# EAGLE design TinyFaceWatch (EAGLE 7.6.0)
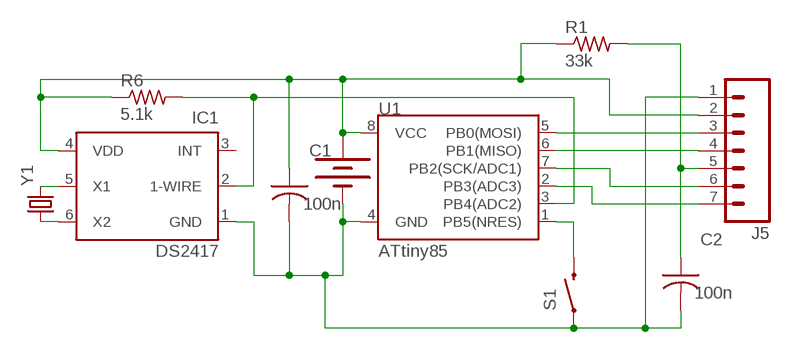
[diagram p0: schematic, sheet 1]

## Parts
BAT1  20mm coincell  BATTERY20MM_4LEGS  [BATTCON_20MM_4LEGS]
C1  100n  C-USC0805K  [C0805K]
C2  100n  C-USC0805K  [C0805K]
IC1  DS2417  DS2417P  [TSOC6]
J5  M07  [1X07]
R1  33k  R-US_M0805  [M0805]
R6  5.1k  R-US_M0805  [M0805]
S1  SWITCH-MOMENTARY-2SMD-4.6X2.8MM  [TACTILE_SWITCH_SMD_4.6X2.8MM]
U1  ATtiny85  ATTINY45TINY45-20-SMT  [SO08-EIAJ]
Y1  CRYSTAL32-SMD-MELF  [CRYSTAL-32KHZ-SMD-MELF]

## Nets
N$1: IC1.5(X1) Y1.X2
N$2: IC1.6(X2) Y1.X1
N$3: J5.4 U1.6(PB1(MISO))
N$4: J5.3 U1.5(PB0(MOSI))
N$5: J5.6 U1.7(PB2(SCK/ADC1))
N$6: J5.7 U1.2(PB3(ADC3))
N$7: BAT1.POSITIVE@1(+) BAT1.POSITIVE@2(+) BAT1.POSITIVE@3(+) BAT1.POSITIVE@4(+) C1.1 IC1.4(VDD) J5.2 R1.1 R6.1 U1.8(VCC)
N$8: C2.1 J5.5 R1.2
N$9: BAT1.NEGATIVE(-) C1.2 C2.2 IC1.1(GND) J5.1 S1.1 S1.2 U1.4(GND)
N$10: S1.3 S1.4 U1.1(PB5(NRES))
N$11: IC1.2(1-WIRE) R6.2 U1.3(PB4(ADC2))

## Power pins joined to a net without a drawn wire
INT: IC1.3(INT)

## Library data of the parts
BAT1 = SparkFun-Electromechanical:BATTERY: Battery Holders Various common sizes : AA, AAA, 18650 (PRT-12895), 20mm coin cell and 12mm coin cell. 20MM_4LEGS, BATT-10373; PROD_ID: BATT-10373
C1 C2 = adafruit:C-US: CAPACITOR, American symbol
IC1 = maxim:DS2417: 1-Wire Digital Potentiometer DALLAS Semiconductor; http://www.maxim-ic.com/; OC_FARNELL: unknown; OC_NEWARK: unknown
J5 = SparkFun-Connectors:M07: Header 7 Standard 7-pin 0.1" header. Use with straight break away headers (SKU : PRT-00116), right angle break away headers (PRT-00553), swiss pins (PRT-00743), machine pins (PRT-00117), and female headers (PRT-00115). NOTES ON THE VARIANTS LOCK and LOCK_LONGPADS... This footprint was designed to help hold the alignment of a through-hole component (i.e. 7-pin header) while soldering it into place. You may notice that each hole has been shifted either up or down by 0.005 of an inch from it's more standard position (which is usually a perfectly straight line). This slight alteration caused the pins (the squares in the middle) to touch the edges of the holes. Because they are alternating, it causes a "brace" to hold the header in place. 0.005 has proven to be the perfect amount of "off-center" position when using our standard breakaway headers. Although looks a little odd when you look at the bare footprint, once you have a header in there, the alteration is very hard to notice. Also, if you push a header all the way into place, it is covered up entirely on the bottom side. This idea of altering the position of holes to aid alignment will be further integrated into the Sparkfun Library for other footprints. It can help hold any component with 3 or more connection pins.
R1 R6 = adafruit:R-US_: RESISTOR, American symbol
S1 = SparkFun-Electromechanical:SWITCH-MOMENTARY-2: Various NO switches- pushbuttons, reed, etc; PROD_ID: SWCH-13065
U1 = SparkFun-DigitalIC:ATTINY45: Atmel 8-pin 2/4/8kB flash uC; PROD_ID: IC-08922; VALUE: Tiny45-20-SMT
Y1 = SparkFun-FreqCtrl:CRYSTAL: Various standard crystals. Proven footprints.; PROD_ID: XTAL-07894

## Board
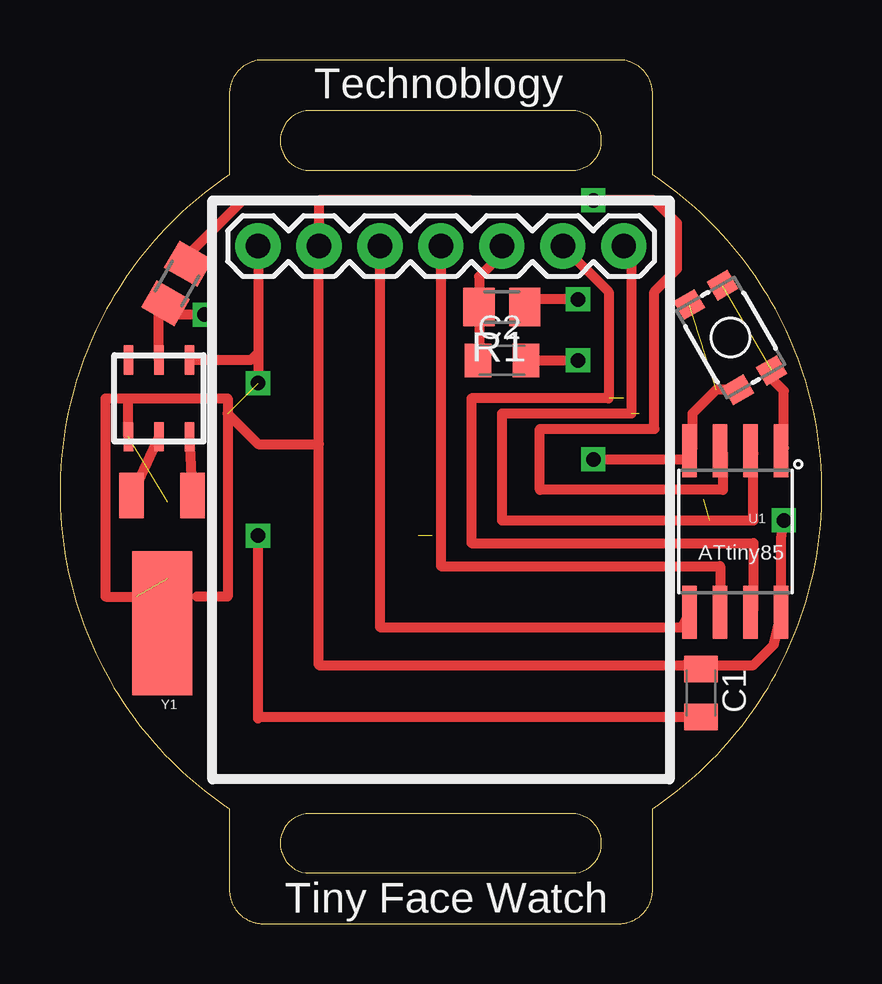
[diagram p1: board, top side]
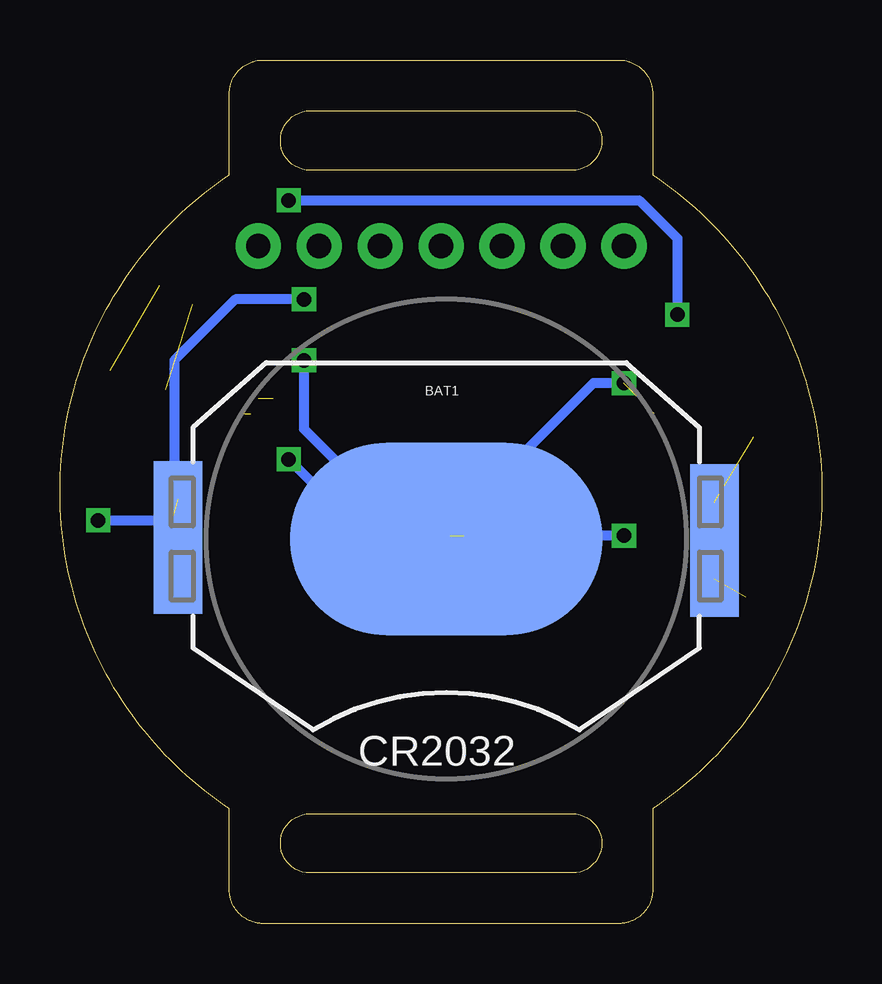
[diagram p2: board, bottom side, seen from below]

Size 31.75 x 35.98 mm. Coordinates in mm from the lower left corner, seen from the top.
Outline: 7.23,0.74 7.2,0.78 7.18,0.82 7.17,0.86 7.15,0.9 7.13,0.95 7.12,0.99 7.11,1.04 7.09,1.08 7.08,1.13 7.08,1.17 7.07,1.22 7.06,1.27 7.06,1.31 7.06,1.36 7.06,4.79 6.79,4.97 6.53,5.15 6.28,5.35 6.02,5.54 5.77,5.74 5.53,5.95 5.29,6.16 5.05,6.37 4.82,6.59 4.6,6.82 4.37,7.05 4.16,7.28 3.94,7.52 3.74,7.76 3.33,8.25 3.14,8.51 2.77,9.03 2.59,9.29 2.42,9.56 2.25,9.84 2.09,10.11 1.78,10.68 1.63,10.96 1.5,11.26 1.36,11.55 1.23,11.85 1.11,12.15 0.99,12.45 0.88,12.75 0.78,13.06 0.68,13.37 0.59,13.69 0.5,14.01 0.42,14.33 0.35,14.65 0.29,14.97 0.22,15.3 0.17,15.63 0.09,16.29 0.05,16.63 0.03,16.97 0.01,17.31 0,17.65 0,18.34 0.01,18.68 0.03,19.02 0.05,19.35 0.09,19.69 0.13,20.02 0.17,20.35 0.22,20.68 0.29,21.01 0.35,21.33 0.42,21.66 0.5,21.98 0.59,22.29 0.68,22.61 0.78,22.92 0.88,23.23 0.99,23.53 1.11,23.84 1.23,24.14 1.36,24.43 1.5,24.73 1.63,25.02 1.78,25.31 1.93,25.59 2.09,25.87 2.25,26.15 2.42,26.42 2.59,26.69 2.77,26.96 3.14,27.48 3.33,27.73 3.53,27.98 3.74,28.23 3.94,28.47 4.16,28.7 4.37,28.94 4.6,29.17 4.82,29.39 5.05,29.61 5.29,29.83 5.53,30.03 5.77,30.24 6.02,30.44 6.28,30.64 6.53,30.83 6.79,31.01 7.06,31.19 7.06,34.62 7.06,34.67 7.06,34.72 7.07,34.76 7.08,34.81 7.08,34.86 7.09,34.9 7.11,34.95 7.12,34.99 7.13,35.04 7.15,35.08 7.17,35.12 7.18,35.16 7.2,35.2 7.23,35.24 7.25,35.28 7.27,35.32 7.3,35.36 7.32,35.4 7.35,35.43 7.38,35.47 7.41,35.5 7.44,35.54 7.5,35.6 7.53,35.63 7.57,35.66 7.6,35.69 7.64,35.72 7.68,35.74 7.72,35.77 7.75,35.79 7.79,35.81 7.83,35.83 7.88,35.85 7.92,35.87 7.96,35.89 8,35.91 8.05,35.92 8.09,35.93 8.14,35.94 8.23,35.96 8.28,35.97 8.32,35.98 8.37,35.98 8.42,35.98 23.33,35.98 23.38,35.98 23.43,35.98 23.48,35.97 23.52,35.96 23.61,35.94 23.66,35.93 23.7,35.92 23.75,35.91 23.79,35.89 23.83,35.87 23.88,35.85 23.92,35.83 23.96,35.81 24,35.79 24.04,35.77 24.07,35.74 24.11,35.72 24.15,35.69 24.18,35.66 24.22,35.63 24.25,35.6 24.28,35.57 24.31,35.54 24.34,35.5 24.37,35.47 24.4,35.43 24.43,35.4 24.45,35.36 24.48,35.32 24.5,35.28 24.52,35.24 24.55,35.2 24.57,35.16 24.58,35.12 24.6,35.08 24.62,35.04 24.63,34.99 24.65,34.95 24.66,34.9 24.67,34.86 24.68,34.81 24.68,34.76 24.69,34.72 24.69,34.67 24.69,34.62 24.69,31.19 24.96,31.01 25.22,30.83 25.48,30.64 25.73,30.44 25.98,30.24 26.46,29.83 26.7,29.61 26.93,29.39 27.15,29.17 27.38,28.94 27.59,28.7 27.81,28.47 28.02,28.23 28.22,27.98 28.42,27.73 28.61,27.48 28.98,26.96 29.16,26.69 29.33,26.42 29.5,26.15 29.66,25.87 29.82,25.59 29.97,25.31 30.12,25.02 30.25,24.73 30.39,24.43 30.52,24.14 30.64,23.84 30.76,23.53 30.87,23.23 30.97,22.92 31.07,22.61 31.16,22.29 31.25,21.98 31.33,21.66 31.4,21.33 31.46,21.01 31.53,20.68 31.58,20.35 31.62,20.02 31.66,19.69 31.7,19.35 31.74,18.68 31.75,18.34 31.75,17.65 31.74,17.31 31.7,16.63 31.66,16.29 31.58,15.63 31.53,15.3 31.46,14.97 31.4,14.65 31.33,14.33 31.25,14.01 31.16,13.69 31.07,13.37 30.97,13.06 30.87,12.75 30.76,12.45 30.64,12.15 30.52,11.85 30.39,11.55 30.25,11.26 30.12,10.96 29.97,10.68 29.82,10.39 29.66,10.11 29.5,9.84 29.33,9.56 29.16,9.29 28.98,9.03 28.61,8.51 28.42,8.25 28.22,8.01 28.02,7.76 27.81,7.52 27.59,7.28 27.38,7.05 27.15,6.82 26.93,6.59 26.7,6.37 26.46,6.16 25.98,5.74 25.73,5.54 25.48,5.35 25.22,5.15 24.96,4.97 24.69,4.79 24.69,1.36 24.69,1.31 24.69,1.27 24.68,1.22 24.68,1.17 24.67,1.13 24.66,1.08 24.65,1.04 24.63,0.99 24.62,0.95 24.6,0.9 24.58,0.86 24.57,0.82 24.55,0.78 24.52,0.74 24.5,0.7 24.48,0.66 24.45,0.62 24.43,0.58 24.4,0.55 24.37,0.51 24.34,0.48 24.31,0.45 24.28,0.41 24.25,0.38 24.22,0.35 24.18,0.32 24.15,0.29 24.11,0.27 24.07,0.24 24.04,0.22 24,0.19 23.96,0.17 23.92,0.15 23.88,0.13 23.83,0.11 23.79,0.09 23.75,0.08 23.66,0.05 23.61,0.04 23.57,0.03 23.52,0.02 23.48,0.01 23.43,0.01 23.38,0 23.33,0 8.42,0 8.37,0 8.32,0.01 8.28,0.01 8.23,0.02 8.18,0.03 8.14,0.04 8.09,0.05 8.05,0.06 8,0.08 7.96,0.09 7.92,0.11 7.88,0.13 7.83,0.15 7.79,0.17 7.75,0.19 7.72,0.22 7.68,0.24 7.64,0.27 7.6,0.29 7.57,0.32 7.53,0.35 7.5,0.38 7.47,0.41 7.44,0.45 7.41,0.48 7.38,0.51 7.35,0.55 7.32,0.58 7.3,0.62 7.27,0.66 7.25,0.7
Outline: 21.5,33.86 10.24,33.86 10.08,33.82 9.93,33.76 9.79,33.7 9.65,33.61 9.54,33.5 9.43,33.39 9.34,33.25 9.28,33.11 9.21,32.96 9.18,32.79 9.18,32.45 9.21,32.29 9.28,32.14 9.34,32 9.43,31.86 9.54,31.75 9.65,31.64 9.79,31.55 9.93,31.49 10.08,31.42 10.24,31.39 21.5,31.39 21.66,31.42 21.81,31.49 21.96,31.55 22.09,31.64 22.2,31.75 22.31,31.86 22.4,32 22.47,32.14 22.53,32.29 22.56,32.45 22.56,32.79 22.53,32.96 22.47,33.11 22.4,33.25 22.31,33.39 22.2,33.5 22.09,33.61 21.96,33.7 21.81,33.76 21.66,33.82 21.5,33.86
Outline: 21.5,4.58 10.24,4.58 10.08,4.55 9.93,4.48 9.79,4.42 9.65,4.33 9.54,4.22 9.43,4.11 9.34,3.97 9.28,3.83 9.21,3.68 9.18,3.52 9.18,3.17 9.21,3.01 9.28,2.86 9.34,2.72 9.43,2.58 9.54,2.47 9.65,2.36 9.79,2.27 9.93,2.21 10.08,2.15 10.24,2.11 21.5,2.11 21.66,2.15 21.81,2.21 21.96,2.27 22.09,2.36 22.2,2.47 22.31,2.58 22.4,2.72 22.47,2.86 22.53,3.01 22.56,3.17 22.56,3.52 22.53,3.68 22.47,3.83 22.4,3.97 22.31,4.11 22.2,4.22 22.09,4.33 21.96,4.42 21.81,4.48 21.66,4.55 21.5,4.58
Copper layers (1*16): Top 0.035mm / dielectric 1.5mm / Bottom 0.035mm
Design rules "default": minimum track width 10mil, minimum drill 24mil, track to track 8mil, track to pad 8mil, pad to pad 8mil, via to via 8mil, smd to smd 8mil, copper to edge 40mil, drill to drill 8mil, minimum pad ring 10mil, minimum via ring 8mil, stop-mask expansion 4mil, vias tented up to drill 0mil, thermal gap 10mil

### Footprints (pad centres in the part's own frame; a part is rotated, then mirrored left to right if it is on the bottom)
BATTCON_20MM_4LEGS = smd 13 x 8: NEGATIVE 0,0 | smd 2.032 x 3.175: POSITIVE@1 -11.176,1.651; POSITIVE@2 -11.176,-1.524; POSITIVE@3 11.176,1.524; POSITIVE@4 11.176,-1.651
C0805K = smd 1.1 x 1.4: 1 -1,0; 2 1,0
TSOC6 = smd 0.406 x 1.219: 1 -1.27,-1.6; 2 0,-1.6; 3 1.27,-1.6; 4 1.27,1.6; 5 0,1.6; 6 -1.27,1.6
1X07 = drill 1.016 pad 1.88: 1 0,0; 2 2.54,0; 3 5.08,0; 4 7.62,0; 5 10.16,0; 6 12.7,0; 7 15.24,0
M0805 = smd 1.3 x 1.6: 1 -0.95,0; 2 0.95,0
TACTILE_SWITCH_SMD_4.6X2.8MM = smd 0.9 x 1: 1 -2.05,-0.8; 2 2.05,-0.8; 3 2.05,0.8; 4 -2.05,0.8
SO08-EIAJ = smd 0.61 x 2.21: 1 -1.905,-3.378; 2 -0.635,-3.378; 3 0.635,-3.378; 4 1.905,-3.378; 5 1.905,3.353; 6 0.635,3.353; 7 -0.635,3.353; 8 -1.905,3.353
CRYSTAL-32KHZ-SMD-MELF = smd 2.5 x 6: SHEILD 0,5.08 | smd 1.016 x 1.905: X1 -1.27,-0.254; X2 1.27,-0.254

### Placement (x,y rotation side)
BAT1  15.66,16.03 0 bottom
C1  26.7,9.6 270 top
C2  18.41,23.47 0 top
IC1  4.12,21.88 180 top
J5  8.25,28.23 0 top
R1  18.41,25.69 180 top
R6  4.87,26.67 240 top
S1  27.94,24.42 300 top
U1  28.14,16.32 180 top
Y1  4.25,17.59 180 top

### Tracks (layer width: path | path; a pad name or v marks a point on that pad's centre or on a via)
N$1
  Top 0.406: IC1.5 Y1.X2
N$2
  Top 0.406: IC1.6 Y1.X1
N$3
  Top 0.406: J5.4 15.87,14.9 27.5,14.9 U1.6
N$4
  Top 0.406: J5.3 13.33,12.36 25.92,12.36 U1.5
N$5  (1 unrouted)
  Top 0.406: U1.7 28.89,13.08 28.89,15.85 17.14,15.85 17.14,21.88 22.86,21.88 22.86,26.33 J5.6
N$6  (1 unrouted)
  Top 0.406: U1.2 28.89,19.58 28.89,16.8 18.41,16.8 18.41,21.25 23.81,21.25 23.81,27.91 J5.7
N$7  (via drill 0.6)  (3 unrouted)
  Top 0.406: 3.17,13.63 1.9,13.63 1.9,21.88 2.85,21.88 | IC1.4 2.85,21.88 | 2.85,21.88 6.98,21.88 6.98,21.25 8.25,19.98 10.79,19.98 | 10.79,19.98 10.79,10.77 26.03,10.77 | 10.79,19.98 J5.2 10.79,30.14 | R6.1 5.51,28.03 7.62,30.14 10.79,30.14 | v30.16,16.8 30.04,16.05 U1.8 29.73,11.61 28.89,10.77 26.03,10.77 | 17.14,30.14 10.79,30.14 | C1.1 26.2,10.6 26.03,10.77 | v21.59,26.01 19.68,26.01 R1.1
  Bottom 0.406: v30.16,16.8 27.07,16.8 BAT1.POSITIVE@2 | v21.59,26.01 24.44,26.01 26.98,23.47 26.98,17.83 BAT1.POSITIVE@1
N$8
  Top 0.406: J5.5 18.41,27.91 17.46,26.96 R1.2 17.46,23.52 C2.1
N$9  (via drill 0.6)  (3 unrouted)
  Top 0.406: J5.1 8.25,23.79 | 8.25,23.79 7.95,23.48 IC1.1 | 8.25,23.79 v8.25,22.52 | 6.98,21.25 6.98,13.63 5.71,13.63 | C1.2 8.25,8.6 | 8.25,8.6 8.25,8.55 | 8.25,8.6 v8.25,16.17 | v22.22,19.34 26.23,19.34 U1.4 26.35,19.81 26.35,21.25 27.35,22.25 S1.2 | C2.2 v21.59,23.47
  Bottom 0.406: v8.25,22.52 9.52,22.52 14.92,17.12 14.92,16.17 | v21.59,23.47 21.59,20.61 19.68,18.71 18.41,18.71 17.14,17.44 18.41,17.44 19.68,16.17 19.05,16.17 | 14.6,16.17 14.92,16.17 | 14.92,16.17 19.05,16.17 | 19.05,16.17 v22.22,19.34 | v8.25,16.17 15.52,16.17 BAT1.NEGATIVE
N$10  (1 unrouted)
  Top 0.406: U1.1 30.16,19.81 30.16,22.2 29.34,23.02 S1.3
N$11  (via drill 0.6)
  Top 0.406: IC1.2 4.12,25.37 4.4,25.65 R6.2 4.55,25.37 v6.03,25.37 | U1.3 27.62,19.58 27.62,18.07 20,18.07 20,20.61 24.76,20.61 24.76,26.33 25.71,27.28 25.71,29.18 24.76,30.14 v22.22,30.14
  Bottom 0.406: v22.22,30.14 7.62,30.14 6.03,28.55 v6.03,25.37

### Text on the board
tNames: Technoblogy | Tiny Face Watch
bNames: CR2032